# Altium project QUTMS_ShutdownDPDT_V00.PrjPcb
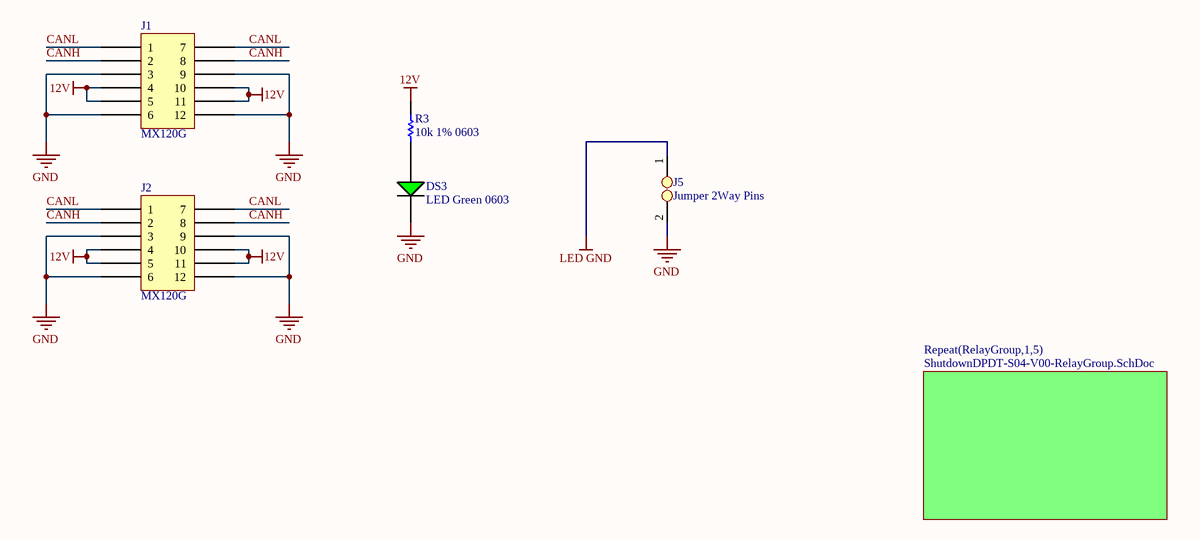
[diagram p0: ShutdownDPDT-S01-V00.SchDoc]
3 sheets, 90 parts. Net scope: flat (ports and power ports of the same name join across sheets).
Board file: ShutdownDPDT-P01-V01.PcbDoc
Sheets:
  ShutdownDPDT-S01-V00.SchDoc
    RelayGroup1 = ShutdownDPDT-S04-V00-RelayGroup.SchDoc
      DPDT_Relay_1 = ShutdownDPDT-S02-V00-Relay.SchDoc
      DPDT_Relay_2 = ShutdownDPDT-S02-V00-Relay.SchDoc
      DPDT_Relay_1 = ShutdownDPDT-S02-V00-Relay.SchDoc
    RelayGroup2 = ShutdownDPDT-S04-V00-RelayGroup.SchDoc
      DPDT_Relay_1 = ShutdownDPDT-S02-V00-Relay.SchDoc
      DPDT_Relay_2 = ShutdownDPDT-S02-V00-Relay.SchDoc
      DPDT_Relay_1 = ShutdownDPDT-S02-V00-Relay.SchDoc
    RelayGroup3 = ShutdownDPDT-S04-V00-RelayGroup.SchDoc
      DPDT_Relay_1 = ShutdownDPDT-S02-V00-Relay.SchDoc
      DPDT_Relay_2 = ShutdownDPDT-S02-V00-Relay.SchDoc
      DPDT_Relay_1 = ShutdownDPDT-S02-V00-Relay.SchDoc
    RelayGroup4 = ShutdownDPDT-S04-V00-RelayGroup.SchDoc
      DPDT_Relay_1 = ShutdownDPDT-S02-V00-Relay.SchDoc
      DPDT_Relay_2 = ShutdownDPDT-S02-V00-Relay.SchDoc
      DPDT_Relay_1 = ShutdownDPDT-S02-V00-Relay.SchDoc
    RelayGroup5 = ShutdownDPDT-S04-V00-RelayGroup.SchDoc
      DPDT_Relay_1 = ShutdownDPDT-S02-V00-Relay.SchDoc
      DPDT_Relay_2 = ShutdownDPDT-S02-V00-Relay.SchDoc
      DPDT_Relay_1 = ShutdownDPDT-S02-V00-Relay.SchDoc

## Sheet ShutdownDPDT-S01-V00.SchDoc
size A3; SheetNumber: 1; SheetTotal: 3

### Parts
(Parts that share a designator on the sheet are numbered #1, #2 ... from top to bottom, then left to right.)
DS3#1  LED Green 0603  [LED GREEN 0603]
J1#1  MX120G  [MX120G]
J2  MX120G  [MX120G]
J5  Jumper 2Way Pins  [Jumper_2Way_Pin]
R3#1  10k 1% 0603  [Res_ThinFilm_0603]

### Sub-sheets
Repeat(RelayGroup,1,5) = ShutdownDPDT-S04-V00-RelayGroup.SchDoc: no entries

### Nets
12V: J1#1.4 J1#1.5 J1#1.10 J1#1.11 J2.4 J2.5 J2.10 J2.11 R3#1.2
GND: DS3#1.2(C) J1#1.3 J1#1.6 J1#1.9 J1#1.12 J2.3 J2.6 J2.9 J2.12 J5.2
LED GND: J5.1
CANH: J1#1.2 J1#1.8 J2.2 J2.8
CANL: J1#1.1 J1#1.7 J2.1 J2.7
NetDS3#1_1: DS3#1.1(A) R3#1.1

### Library data of the parts
J1#1 J2 = MX120G: MX120G with standard connector layout
J5 = Jumper 2Way Vert Pins
R3#1 = 10k 1% 0603: Resistor, SMD, 10k, 0.1W, 1%, 0603

## Sheet ShutdownDPDT-S04-V00-RelayGroup.SchDoc
size A3; SheetNumber: 2; SheetTotal: 3
Used 5 times, as channels RelayGroup1, RelayGroup2, RelayGroup3, RelayGroup4, RelayGroup5. Parts and nets are listed once, with the designators drawn on the sheet.
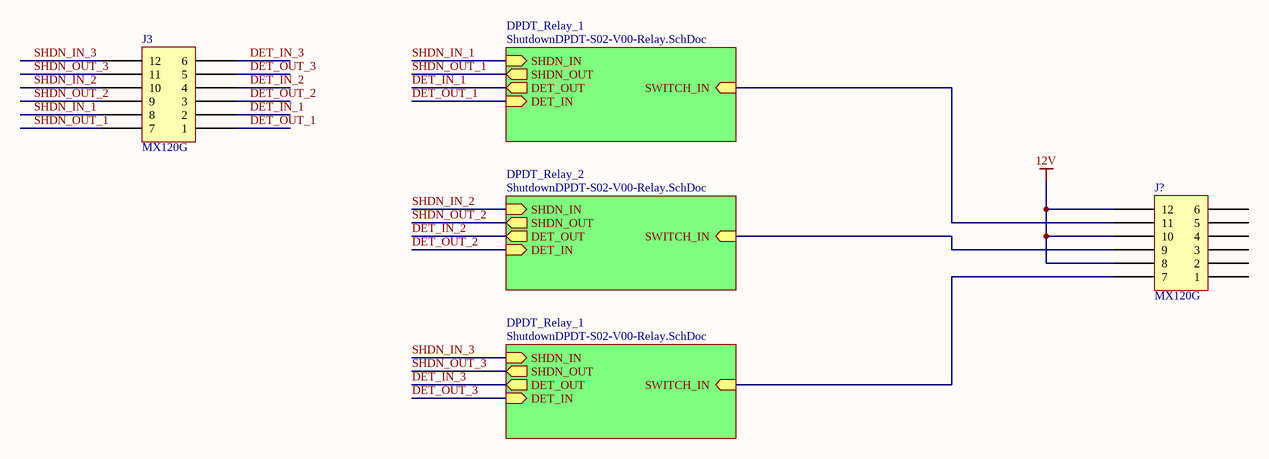
[diagram p1: ShutdownDPDT-S04-V00-RelayGroup.SchDoc]

### Parts
J3  MX120G  [MX120G]
J?  MX120G  [MX120G]

### Sub-sheets
DPDT_Relay_1 = ShutdownDPDT-S02-V00-Relay.SchDoc: SWITCH_IN (in), SHDN_IN (in), SHDN_OUT (out), DET_OUT (out), DET_IN (in)
DPDT_Relay_1 = ShutdownDPDT-S02-V00-Relay.SchDoc: SWITCH_IN (in), SHDN_IN (in), SHDN_OUT (out), DET_OUT (out), DET_IN (in)
DPDT_Relay_2 = ShutdownDPDT-S02-V00-Relay.SchDoc: SWITCH_IN (in), SHDN_IN (in), SHDN_OUT (out), DET_OUT (out), DET_IN (in)

### Nets
12V: J?.8 J?.10 J?.12
DET_IN_1: J3.2 ; sheet DPDT_Relay_1/DET_OUT
DET_IN_2: J3.4 ; sheet DPDT_Relay_2/DET_OUT
DET_IN_3: J3.6 ; sheet DPDT_Relay_1/DET_OUT
DET_OUT_1: J3.1 ; sheet DPDT_Relay_1/DET_IN
DET_OUT_2: J3.3 ; sheet DPDT_Relay_2/DET_IN
DET_OUT_3: J3.5 ; sheet DPDT_Relay_1/DET_IN
SHDN_IN_1: J3.8 ; sheet DPDT_Relay_1/SHDN_IN
SHDN_IN_2: J3.10 ; sheet DPDT_Relay_2/SHDN_IN
SHDN_IN_3: J3.12 ; sheet DPDT_Relay_1/SHDN_IN
SHDN_OUT_1: J3.7 ; sheet DPDT_Relay_1/SHDN_OUT
SHDN_OUT_2: J3.9 ; sheet DPDT_Relay_2/SHDN_OUT
SHDN_OUT_3: J3.11 ; sheet DPDT_Relay_1/SHDN_OUT
NetJ?_7: J?.7 ; sheet DPDT_Relay_1/SWITCH_IN
NetJ?_9: J?.9 ; sheet DPDT_Relay_2/SWITCH_IN
NetJ?_11: J?.11 ; sheet DPDT_Relay_1/SWITCH_IN

Not connected (* = marked no-connect by the designer): J? 1 2 3 4 5 6

### Channels
RelayGroup1: designators J3=J4 J?=J?A1
RelayGroup2: designators J3=J6 J?=J?B1
RelayGroup3: designators J3=J3 J?=J?C1
RelayGroup4: designators J3=J1#2 J?=J?D1
RelayGroup5: designators J3=J7 J?=J?E1

### Library data of the parts
J3 J? = MX120G: MX120G with standard connector layout

## Sheet ShutdownDPDT-S02-V00-Relay.SchDoc
size A4; SheetNumber: 3; SheetTotal: 4
Used 15 times, as channels RelayGroup1/DPDT_Relay_1, RelayGroup1/DPDT_Relay_2, RelayGroup1/DPDT_Relay_1, RelayGroup2/DPDT_Relay_1, RelayGroup2/DPDT_Relay_2, RelayGroup2/DPDT_Relay_1, RelayGroup3/DPDT_Relay_1, RelayGroup3/DPDT_Relay_2, RelayGroup3/DPDT_Relay_1, RelayGroup4/DPDT_Relay_1, RelayGroup4/DPDT_Relay_2, RelayGroup4/DPDT_Relay_1, RelayGroup5/DPDT_Relay_1, RelayGroup5/DPDT_Relay_2, RelayGroup5/DPDT_Relay_1. Parts and nets are listed once, with the designators drawn on the sheet.
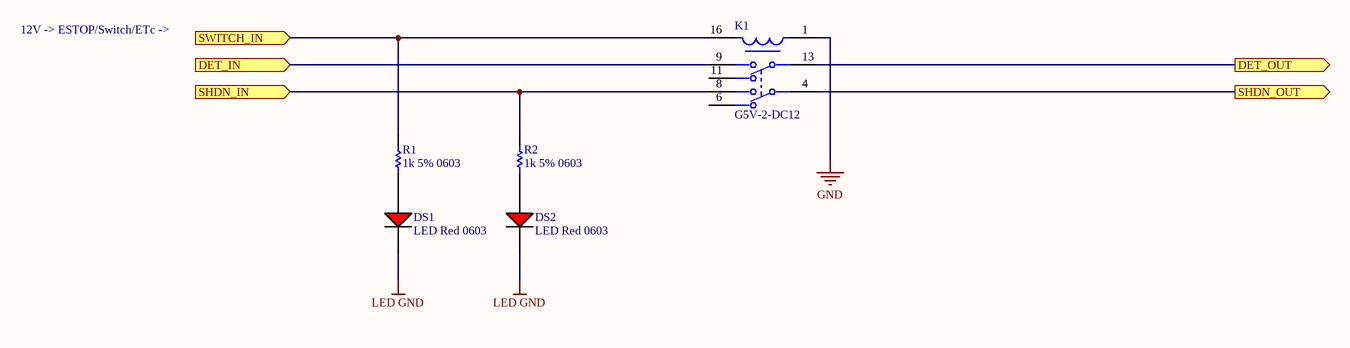
[diagram p2: ShutdownDPDT-S02-V00-Relay.SchDoc]

### Parts
DS1  LED Red 0603  [LED RED 0603]
DS2  LED Red 0603  [LED RED 0603]
K1  G5V-2-DC12  [FP-G5V-2-DC12-MFG]
R1  1k 5% 0603  [Res_ThinFilm_0603]
R2  1k 5% 0603  [Res_ThinFilm_0603]

### Ports
DET_IN (in), DET_OUT (out), SHDN_IN (in), SHDN_OUT (out), SWITCH_IN (in)

### Nets
GND: K1.1
LED GND: DS1.2(C) DS2.2(C)
DET_IN: K1.9 ; port DET_IN
DET_OUT: K1.13 ; port DET_OUT
SHDN_IN: K1.8 R2.2 ; port SHDN_IN
SHDN_OUT: K1.4 ; port SHDN_OUT
SWITCH_IN: K1.16 R1.2 ; port SWITCH_IN
NetDS1_1: DS1.1(A) R1.1
NetDS2_1: DS2.1(A) R2.1

Not connected (* = marked no-connect by the designer): K1 6 11

### Channels
RelayGroup1/DPDT_Relay_1: designators DS1=DS13 DS2=DS14 K1=K7 R1=R14 R2=R13; ports DET_IN=NetK1_9 DET_OUT=NetK1_13 SHDN_IN=NetK1_8 SHDN_OUT=NetK1_4 SWITCH_IN=NetK1_16
RelayGroup1/DPDT_Relay_2: designators DS1=DS15 DS2=DS16 K1=K8 R1=R16 R2=R15; ports DET_IN=NetK1_9 DET_OUT=NetK1_13 SHDN_IN=NetK1_8 SHDN_OUT=NetK1_4 SWITCH_IN=NetK1_16
RelayGroup1/DPDT_Relay_1: designators DS1=DS17 DS2=DS18 K1=K9 R1=R18 R2=R17; ports DET_IN=NetK1_9 DET_OUT=NetK1_13 SHDN_IN=NetK1_8 SHDN_OUT=NetK1_4 SWITCH_IN=NetK1_16
RelayGroup2/DPDT_Relay_1: designators DS1=DS19 DS2=DS20 K1=K10 R1=R20 R2=R19; ports DET_IN=NetK1_9 DET_OUT=NetK1_13 SHDN_IN=NetK1_8 SHDN_OUT=NetK1_4 SWITCH_IN=NetK1_16
RelayGroup2/DPDT_Relay_2: designators DS1=DS21 DS2=DS22 K1=K11 R1=R22 R2=R21; ports DET_IN=NetK1_9 DET_OUT=NetK1_13 SHDN_IN=NetK1_8 SHDN_OUT=NetK1_4 SWITCH_IN=NetK1_16
RelayGroup2/DPDT_Relay_1: designators DS1=DS23 DS2=DS24 K1=K12 R1=R24 R2=R23; ports DET_IN=NetK1_9 DET_OUT=NetK1_13 SHDN_IN=NetK1_8 SHDN_OUT=NetK1_4 SWITCH_IN=NetK1_16
RelayGroup3/DPDT_Relay_1: designators DS1=DS7 DS2=DS8 K1=K4 R1=R8 R2=R7; ports DET_IN=NetK1_9 DET_OUT=NetK1_13 SHDN_IN=NetK1_8 SHDN_OUT=NetK1_4 SWITCH_IN=NetK1_16
RelayGroup3/DPDT_Relay_2: designators DS1=DS9 DS2=DS10 K1=K5 R1=R10 R2=R9; ports DET_IN=NetK1_9 DET_OUT=NetK1_13 SHDN_IN=NetK1_8 SHDN_OUT=NetK1_4 SWITCH_IN=NetK1_16
RelayGroup3/DPDT_Relay_1: designators DS1=DS11 DS2=DS12 K1=K6 R1=R12 R2=R11; ports DET_IN=NetK1_9 DET_OUT=NetK1_13 SHDN_IN=NetK1_8 SHDN_OUT=NetK1_4 SWITCH_IN=NetK1_16
RelayGroup4/DPDT_Relay_1: designators DS1=DS1 DS2=DS2 K1=K1 R1=R2 R2=R1; ports DET_IN=NetK1_9 DET_OUT=NetK1_13 SHDN_IN=NetK1_8 SHDN_OUT=NetK1_4 SWITCH_IN=NetK1_16
RelayGroup4/DPDT_Relay_2: designators DS1=DS3#2 DS2=DS4 K1=K2 R1=R4 R2=R3#2; ports DET_IN=NetK1_9 DET_OUT=NetK1_13 SHDN_IN=NetK1_8 SHDN_OUT=NetK1_4 SWITCH_IN=NetK1_16
RelayGroup4/DPDT_Relay_1: designators DS1=DS5 DS2=DS6 K1=K3 R1=R6 R2=R5; ports DET_IN=NetK1_9 DET_OUT=NetK1_13 SHDN_IN=NetK1_8 SHDN_OUT=NetK1_4 SWITCH_IN=NetK1_16
RelayGroup5/DPDT_Relay_1: designators DS1=DS25 DS2=DS26 K1=K13 R1=R26 R2=R25; ports DET_IN=NetK1_9 DET_OUT=NetK1_13 SHDN_IN=NetK1_8 SHDN_OUT=NetK1_4 SWITCH_IN=NetK1_16
RelayGroup5/DPDT_Relay_2: designators DS1=DS27 DS2=DS28 K1=K14 R1=R28 R2=R27; ports DET_IN=NetK1_9 DET_OUT=NetK1_13 SHDN_IN=NetK1_8 SHDN_OUT=NetK1_4 SWITCH_IN=NetK1_16
RelayGroup5/DPDT_Relay_1: designators DS1=DS29 DS2=DS30 K1=K15 R1=R30 R2=R29; ports DET_IN=NetK1_9 DET_OUT=NetK1_13 SHDN_IN=NetK1_8 SHDN_OUT=NetK1_4 SWITCH_IN=NetK1_16

### Notes on the sheet
- 12V -> ESTOP/Switch/ETc ->

### Library data of the parts
K1 = CMP-08823-000082-1: RELAY GEN PURPOSE DPDT 2A 12VDC; Manufacturer Series: G5V-2; Relay Action: MOMENTARY; Coil Voltage (DC): 12V; Power Consumption: 500mW; Operate Time: 7ms; Reference Standard: UL; Relay Type: General Purpose; Voltage Rating (DC): 125V; Coil Current: 41.7mA; Coil Type: Non-Latching; Release Time: 3ms; Coil Resistance: 288R; Throw Configuration: DPDT; Depth: 10.1mm; Relay Function: DPDT; Mount: Through Hole; Current Rating: 2A; Number of Pins: 8; Weight: 5g; Coil Power: 500mW; Radiation Hardening: No; Case/Package: DIP; Series: G5V-2; Height: 11.5mm; Width: 10.1mm; Voltage Rating (AC): 125V; Approvals: UL; Contact Material: Gold; Max Current Rating: 2A; Max Operating Temperature: 65°C; Min Operating Temperature: -25°C; Contact Current Rating: 2A; Termination: PC Pin; Max Voltage Rating (DC): 125V; Lead Free: Lead Free; Max Voltage Rating (AC): 125V; Power Rating: 500mW; Type: Electromechanical; Packaging: Rail/Tube; Package Quantity: 25; Length: 20.5mm
R1 R2 = 1k 5% 0603: Resistor, SMD, 1k, 0.1W, 5%, 0603

## Nets that join several sheets
12V: ShutdownDPDT-S01-V00 (9 pins), RelayGroup1 (J?A1.8 J?A1.10 J?A1.12), RelayGroup2 (J?B1.8 J?B1.10 J?B1.12), RelayGroup3 (J?C1.8 J?C1.10 J?C1.12), RelayGroup4 (J?D1.8 J?D1.10 J?D1.12), RelayGroup5 (J?E1.8 J?E1.10 J?E1.12)
GND: ShutdownDPDT-S01-V00 (10 pins), RelayGroup1/DPDT_Relay_1 (K7.1), RelayGroup1/DPDT_Relay_2 (K8.1), RelayGroup1/DPDT_Relay_1 (K9.1), RelayGroup2/DPDT_Relay_1 (K10.1), RelayGroup2/DPDT_Relay_2 (K11.1), RelayGroup2/DPDT_Relay_1 (K12.1), RelayGroup3/DPDT_Relay_1 (K4.1), RelayGroup3/DPDT_Relay_2 (K5.1), RelayGroup3/DPDT_Relay_1 (K6.1), RelayGroup4/DPDT_Relay_1 (K1.1), RelayGroup4/DPDT_Relay_2 (K2.1), RelayGroup4/DPDT_Relay_1 (K3.1), RelayGroup5/DPDT_Relay_1 (K13.1), RelayGroup5/DPDT_Relay_2 (K14.1), RelayGroup5/DPDT_Relay_1 (K15.1)
LED GND: ShutdownDPDT-S01-V00 (J5.1), RelayGroup1/DPDT_Relay_1 (DS13.2 DS14.2), RelayGroup1/DPDT_Relay_2 (DS15.2 DS16.2), RelayGroup1/DPDT_Relay_1 (DS17.2 DS18.2), RelayGroup2/DPDT_Relay_1 (DS19.2 DS20.2), RelayGroup2/DPDT_Relay_2 (DS21.2 DS22.2), RelayGroup2/DPDT_Relay_1 (DS23.2 DS24.2), RelayGroup3/DPDT_Relay_1 (DS7.2 DS8.2), RelayGroup3/DPDT_Relay_2 (DS9.2 DS10.2), RelayGroup3/DPDT_Relay_1 (DS11.2 DS12.2), RelayGroup4/DPDT_Relay_1 (DS1.2 DS2.2), RelayGroup4/DPDT_Relay_2 (DS3#2.2 DS4.2), RelayGroup4/DPDT_Relay_1 (DS5.2 DS6.2), RelayGroup5/DPDT_Relay_1 (DS25.2 DS26.2), RelayGroup5/DPDT_Relay_2 (DS27.2 DS28.2), RelayGroup5/DPDT_Relay_1 (DS29.2 DS30.2)
NetK1_4: RelayGroup1/DPDT_Relay_1 (K7.4), RelayGroup1/DPDT_Relay_2 (K8.4), RelayGroup1/DPDT_Relay_1 (K9.4), RelayGroup2/DPDT_Relay_1 (K10.4), RelayGroup2/DPDT_Relay_2 (K11.4), RelayGroup2/DPDT_Relay_1 (K12.4), RelayGroup3/DPDT_Relay_1 (K4.4), RelayGroup3/DPDT_Relay_2 (K5.4), RelayGroup3/DPDT_Relay_1 (K6.4), RelayGroup4/DPDT_Relay_1 (K1.4), RelayGroup4/DPDT_Relay_2 (K2.4), RelayGroup4/DPDT_Relay_1 (K3.4), RelayGroup5/DPDT_Relay_1 (K13.4), RelayGroup5/DPDT_Relay_2 (K14.4), RelayGroup5/DPDT_Relay_1 (K15.4)
NetK1_8: RelayGroup1/DPDT_Relay_1 (K7.8 R13.2), RelayGroup1/DPDT_Relay_2 (K8.8 R15.2), RelayGroup1/DPDT_Relay_1 (K9.8 R17.2), RelayGroup2/DPDT_Relay_1 (K10.8 R19.2), RelayGroup2/DPDT_Relay_2 (K11.8 R21.2), RelayGroup2/DPDT_Relay_1 (K12.8 R23.2), RelayGroup3/DPDT_Relay_1 (K4.8 R7.2), RelayGroup3/DPDT_Relay_2 (K5.8 R9.2), RelayGroup3/DPDT_Relay_1 (K6.8 R11.2), RelayGroup4/DPDT_Relay_1 (K1.8 R1.2), RelayGroup4/DPDT_Relay_2 (K2.8 R3#2.2), RelayGroup4/DPDT_Relay_1 (K3.8 R5.2), RelayGroup5/DPDT_Relay_1 (K13.8 R25.2), RelayGroup5/DPDT_Relay_2 (K14.8 R27.2), RelayGroup5/DPDT_Relay_1 (K15.8 R29.2)
NetK1_9: RelayGroup1/DPDT_Relay_1 (K7.9), RelayGroup1/DPDT_Relay_2 (K8.9), RelayGroup1/DPDT_Relay_1 (K9.9), RelayGroup2/DPDT_Relay_1 (K10.9), RelayGroup2/DPDT_Relay_2 (K11.9), RelayGroup2/DPDT_Relay_1 (K12.9), RelayGroup3/DPDT_Relay_1 (K4.9), RelayGroup3/DPDT_Relay_2 (K5.9), RelayGroup3/DPDT_Relay_1 (K6.9), RelayGroup4/DPDT_Relay_1 (K1.9), RelayGroup4/DPDT_Relay_2 (K2.9), RelayGroup4/DPDT_Relay_1 (K3.9), RelayGroup5/DPDT_Relay_1 (K13.9), RelayGroup5/DPDT_Relay_2 (K14.9), RelayGroup5/DPDT_Relay_1 (K15.9)
NetK1_13: RelayGroup1/DPDT_Relay_1 (K7.13), RelayGroup1/DPDT_Relay_2 (K8.13), RelayGroup1/DPDT_Relay_1 (K9.13), RelayGroup2/DPDT_Relay_1 (K10.13), RelayGroup2/DPDT_Relay_2 (K11.13), RelayGroup2/DPDT_Relay_1 (K12.13), RelayGroup3/DPDT_Relay_1 (K4.13), RelayGroup3/DPDT_Relay_2 (K5.13), RelayGroup3/DPDT_Relay_1 (K6.13), RelayGroup4/DPDT_Relay_1 (K1.13), RelayGroup4/DPDT_Relay_2 (K2.13), RelayGroup4/DPDT_Relay_1 (K3.13), RelayGroup5/DPDT_Relay_1 (K13.13), RelayGroup5/DPDT_Relay_2 (K14.13), RelayGroup5/DPDT_Relay_1 (K15.13)
NetK1_16: RelayGroup1/DPDT_Relay_1 (K7.16 R14.2), RelayGroup1/DPDT_Relay_2 (K8.16 R16.2), RelayGroup1/DPDT_Relay_1 (K9.16 R18.2), RelayGroup2/DPDT_Relay_1 (K10.16 R20.2), RelayGroup2/DPDT_Relay_2 (K11.16 R22.2), RelayGroup2/DPDT_Relay_1 (K12.16 R24.2), RelayGroup3/DPDT_Relay_1 (K4.16 R8.2), RelayGroup3/DPDT_Relay_2 (K5.16 R10.2), RelayGroup3/DPDT_Relay_1 (K6.16 R12.2), RelayGroup4/DPDT_Relay_1 (K1.16 R2.2), RelayGroup4/DPDT_Relay_2 (K2.16 R4.2), RelayGroup4/DPDT_Relay_1 (K3.16 R6.2), RelayGroup5/DPDT_Relay_1 (K13.16 R26.2), RelayGroup5/DPDT_Relay_2 (K14.16 R28.2), RelayGroup5/DPDT_Relay_1 (K15.16 R30.2)